# Altium schematic sheet 3V3BUCK.SchDoc
size A
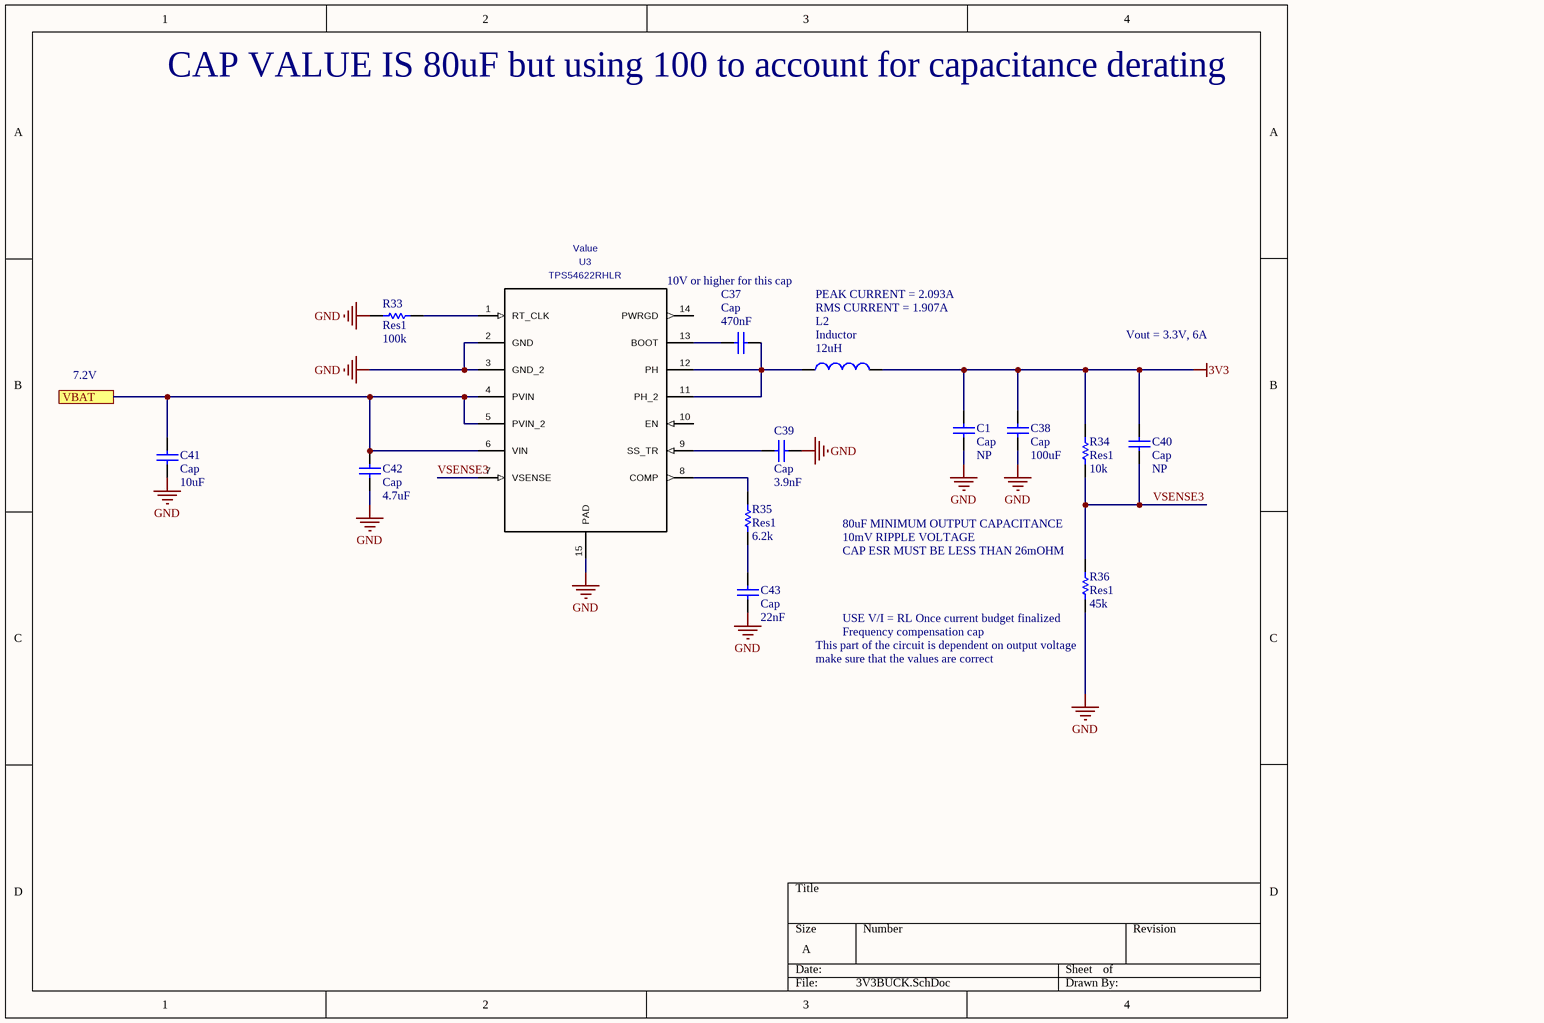
[diagram p0: 3V3BUCK.SchDoc]

## Parts
C1  Cap  value NP  [1608[0603]]
C37  Cap  value 470nF  [0402-A]
C38  Cap  value 100uF  [C1210]
C39  Cap  value 3.9nF  [0402-A]
C40  Cap  value NP  [1608[0603]]
C41  Cap  value 10uF  [6-0805_M]
C42  Cap  value 4.7uF  [6-0805_M]
C43  Cap  value 22nF  [0402-A]
L2  Inductor  value 12uH  [IND_BOURNS_SRR1260]
R33  Res1  value 100k  [0402-A]
R34  Res1  value 10k  [0402-A]
R35  Res1  value 6.2k  [0402-A]
R36  Res1  value 45k  [0402-A]
U3  TPS54622RHLR  [RHL0014A]

## Ports
VBAT

## Nets
3V3: C1.2 C38.2 C40.2 L2.2 R34.1
GND: C1.1 C38.1 C39.1 C41.1 C42.1 C43.1 R33.1 R36.1 U3.2(GND) U3.3(GND_2) U3.15(PAD)
VBAT: C41.2 C42.2 U3.4(PVIN) U3.5(PVIN_2) U3.6(VIN) ; port VBAT
VSENSE3: C40.1 R34.2 R36.2 U3.7(VSENSE)
NetC37_1: C37.1 U3.13(BOOT)
NetC37_2: C37.2 L2.1 U3.11(PH_2) U3.12(PH)
NetC39_2: C39.2 U3.9(SS_TR)
NetC43_2: C43.2 R35.1
NetR33_2: R33.2 U3.1(RT_CLK)
NetR35_2: R35.2 U3.8(COMP)

Not connected (* = marked no-connect by the designer): U3 10(EN) 14(PWRGD)

## Notes on the sheet
- CAP VALUE IS 80uF but using 100 to account for capacitance derating
- (near U3) 10V or higher for this cap
- PEAK CURRENT = 2.093A
- RMS CURRENT = 1.907A
- Vout = 3.3V, 6A
- 7.2V
- 80uF MINIMUM OUTPUT CAPACITANCE
- 10mV RIPPLE VOLTAGE
- (near R36) CAP ESR MUST BE LESS THAN 26mOHM
- (near R36) USE V/I = RL Once current budget finalized
- Frequency compensation cap
- (near R36) This part of the circuit is dependent on output voltage
- make sure that the values are correct

## Library data of the parts
C1 C37-C43 = Cap: Capacitor; Published: 8-Jun-2000; LatestRevisionDate: 17-Jul-2002; LatestRevisionNote: Re-released for DXP Platform.; PackageReference: RAD-0.3; Publisher: Altium Limited; PackageDescription: Radial Cap, Thru-Hole; 2 Leads; 0.3 in Pin Spacing
L2 = Inductor: Code_IEC: 1005; Published: 8-Jun-2000; LatestRevisionDate: 29-May-2009; LatestRevisionNote: IPC-7351 Footprint Added.; PackageReference: 0402-A; Publisher: Altium Limited; PackageDescription: Chip Inductor; Code_JEITA: 0402
R33-R35 = Res1: Resistor; Published: 8-Jun-2000; LatestRevisionDate: 17-Jul-2002; LatestRevisionNote: Re-released for DXP Platform.; PackageReference: AXIAL-0.3; Publisher: Altium Limited; PackageDescription: Axial Device, Thru-Hole; 2 Leads; 0.3 in Pin Spacing
R36 = Res1: Resistor 1%; Published: 8-Jun-2000; LatestRevisionDate: 17-Jul-2002; LatestRevisionNote: Re-released for DXP Platform.; PackageReference: AXIAL-0.3; Publisher: Altium Limited; PackageDescription: Axial Device, Thru-Hole; 2 Leads; 0.3 in Pin Spacing
U3 = TPS54622RHLR: Manufacturer: Texas Instruments; CompType: IC; PIN_COUNT: 15; PartNumber: TPS54622RHLR; PackageReference: RHL0014A; MountType: SMT; RoHS: Y; Value: Value